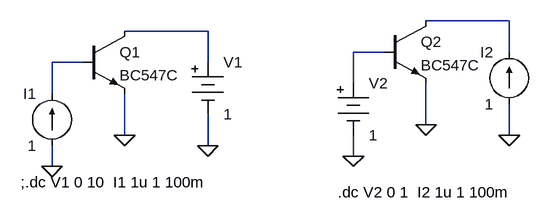
[diagram p0: schematic Draft3.asc]
Draft3.asc, the LTspice schematic file:
Version 4
SHEET 1 1012 680
WIRE 800 32 672 32
WIRE 336 48 208 48
WIRE 608 80 560 80
WIRE 800 80 800 32
WIRE 144 96 96 96
WIRE 336 96 336 48
WIRE 560 128 560 80
WIRE 96 144 96 96
WIRE 672 192 672 128
WIRE 208 208 208 144
WIRE 800 208 800 160
WIRE 336 224 336 176
WIRE 560 240 560 208
WIRE 96 256 96 224
FLAG 96 256 0
FLAG 208 208 0
FLAG 336 224 0
FLAG 560 240 0
FLAG 672 192 0
FLAG 800 208 0
SYMBOL current 96 224 R180
WINDOW 0 24 80 Left 2
WINDOW 3 24 0 Left 2
WINDOW 123 0 0 Left 0
WINDOW 39 0 0 Left 0
SYMATTR InstName I1
SYMATTR Value 1
SYMBOL npn 608 32 R0
SYMATTR InstName Q2
SYMATTR Value BC547C
SYMBOL Misc\\battery 336 80 R0
WINDOW 123 0 0 Left 0
WINDOW 39 0 0 Left 0
SYMATTR InstName V1
SYMATTR Value 1
SYMBOL current 800 160 R180
WINDOW 0 24 80 Left 2
WINDOW 3 24 0 Left 2
WINDOW 123 0 0 Left 0
WINDOW 39 0 0 Left 0
SYMATTR InstName I2
SYMATTR Value 1
SYMBOL npn 144 48 R0
SYMATTR InstName Q1
SYMATTR Value BC547C
SYMBOL Misc\\battery 560 112 R0
WINDOW 123 0 0 Left 0
WINDOW 39 0 0 Left 0
SYMATTR InstName V2
SYMATTR Value 1
TEXT 48 280 Left 2 !;.dc V1 0 10  I1 1u 1 100m
TEXT 536 296 Left 2 !.dc V2 0 1  I2 1u 1 100m

The netlist it stands for:
* Draft3.asc
I1 0 N004 1
Q2 N001 N003 0 0 BC547C
V1 N002 0 1
I2 0 N001 1
Q1 N002 N004 0 0 BC547C
V2 N003 0 1
.model NPN NPN
.model PNP PNP
.lib standard.bjt
;.dc V1 0 10  I1 1u 1 100m
.dc V2 0 1  I2 1u 1 100m
.backanno
.end